# Altium schematic sheet TopLevel.SchDoc
size A4
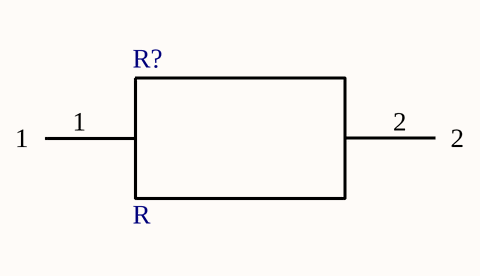
[diagram p0: TopLevel.SchDoc]

## Parts
R?  R  [R_0402]

## Nets

Not connected (* = marked no-connect by the designer): R? 1 2